# Altium schematic sheet BQ40Z50.SchDoc
size A2
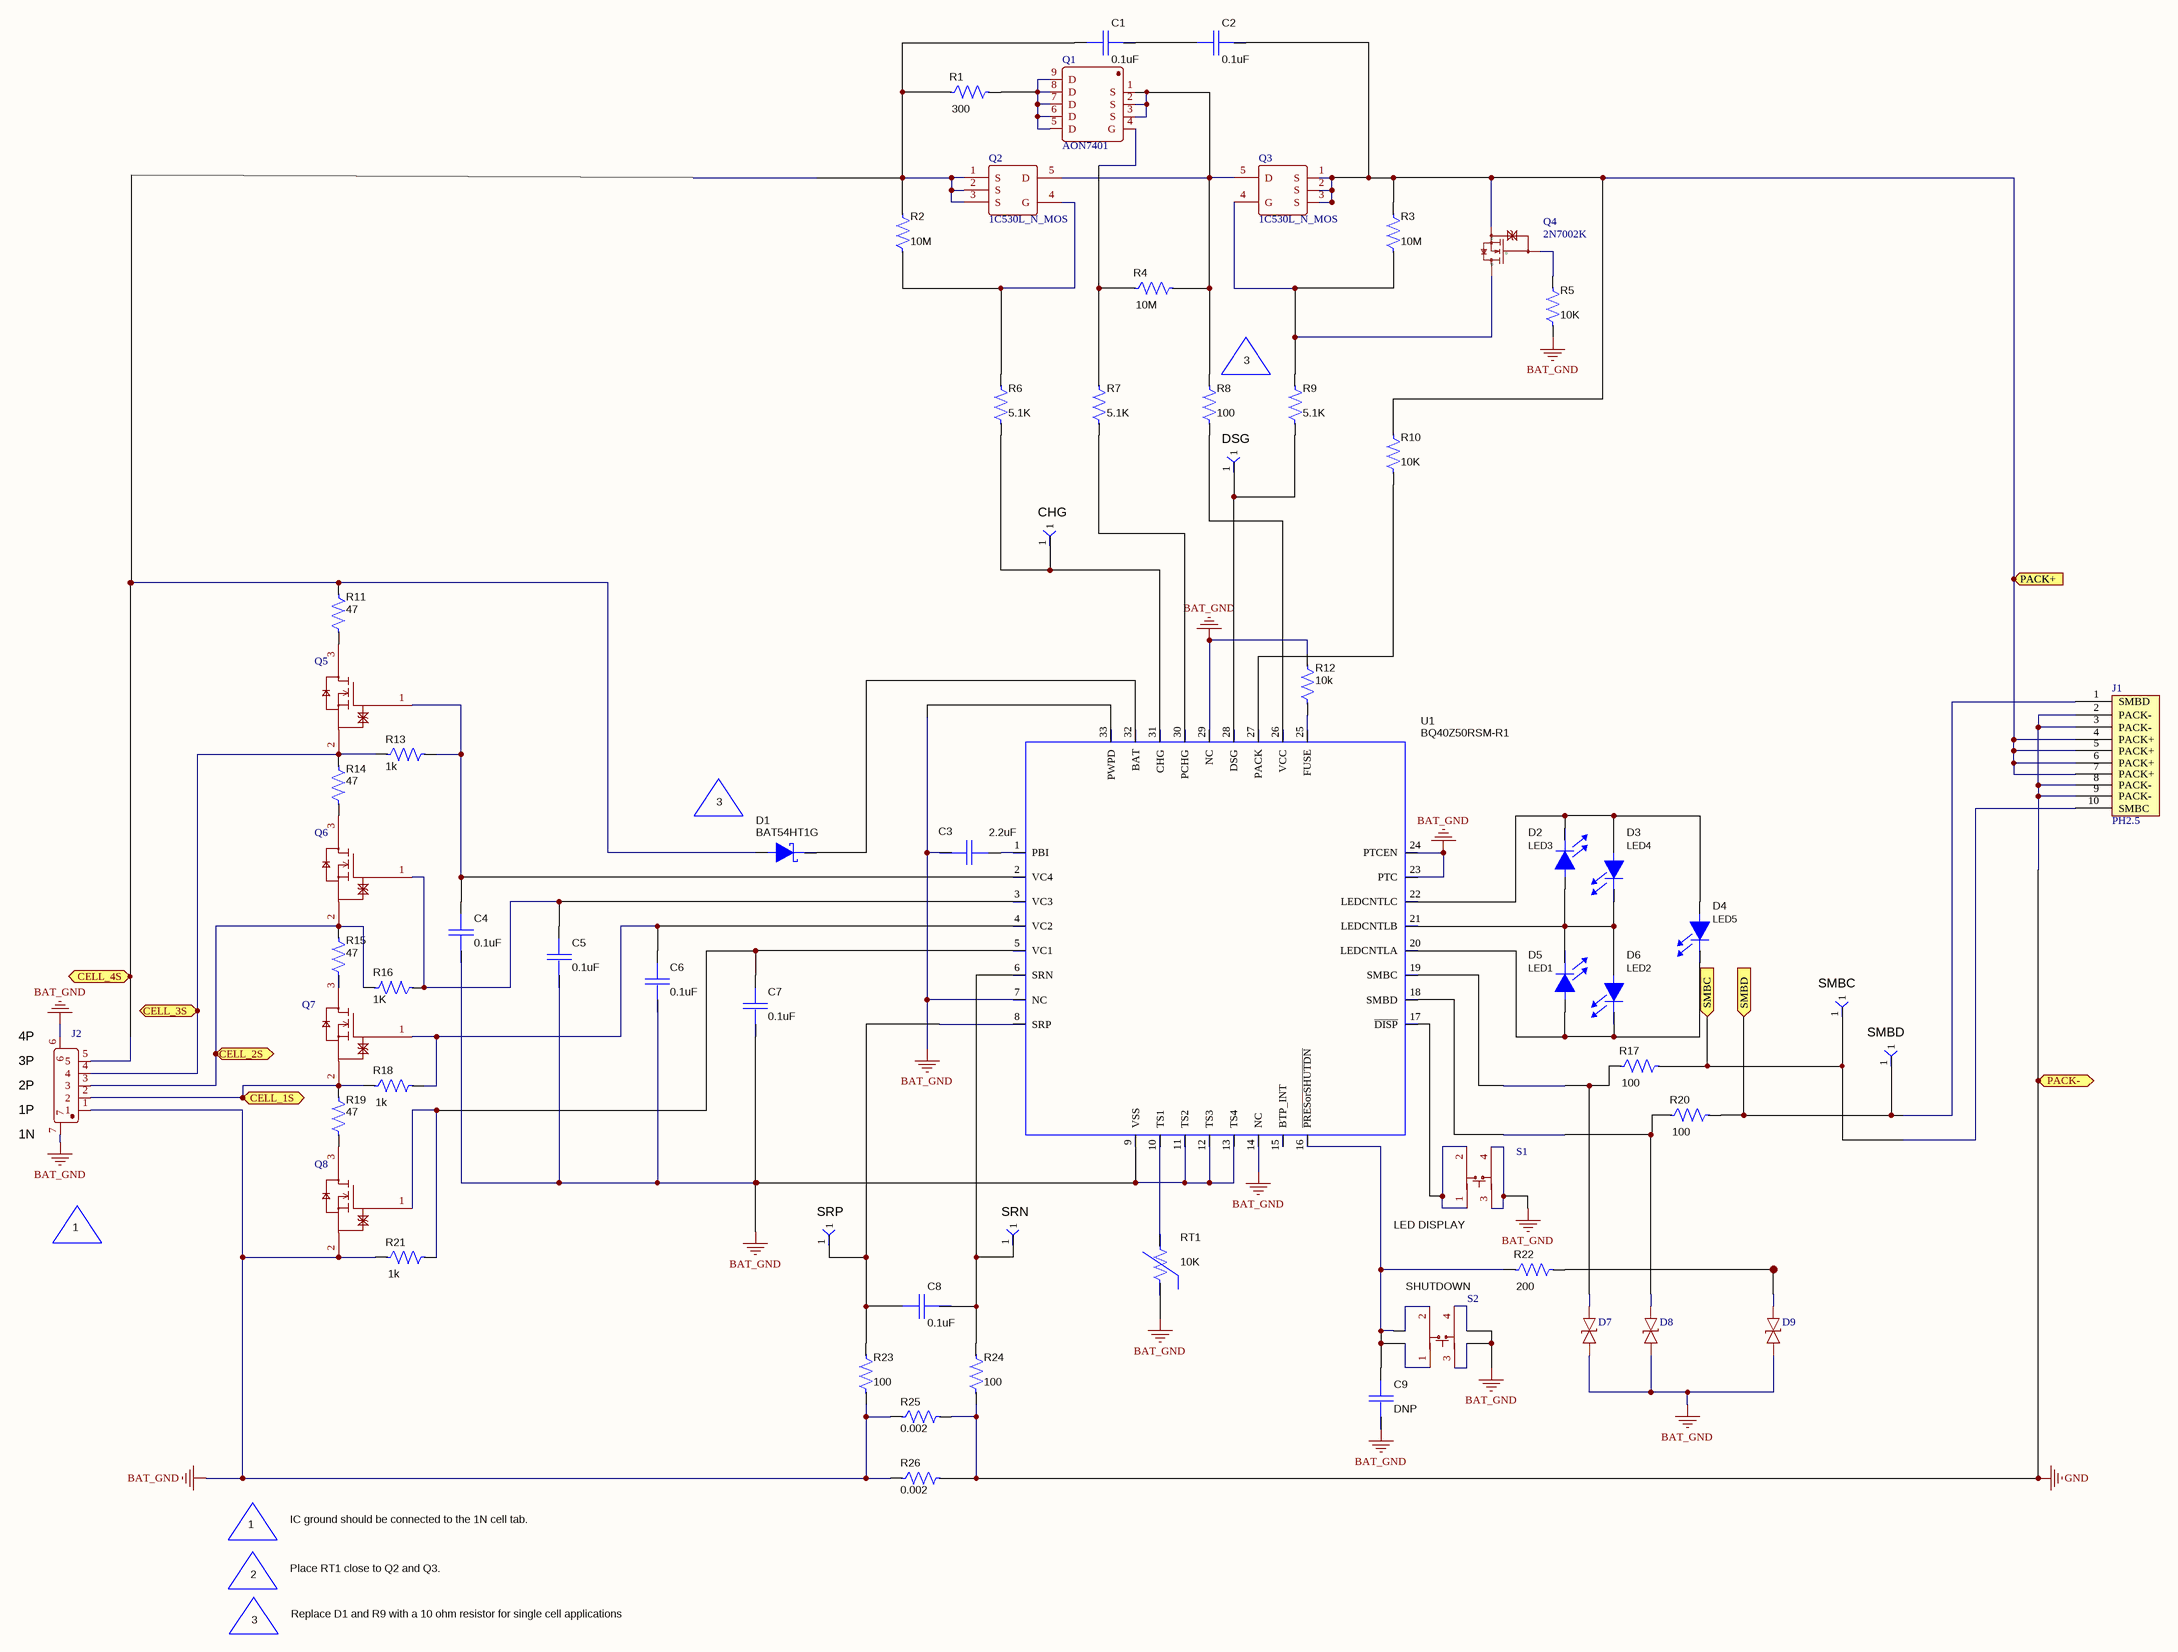
[diagram p0: BQ40Z50.SchDoc]

## Parts
C1  value 0.1uF  [C603]  (hidden comment: C0603C104M5RACTU)
C2  value 0.1uF  [C603]  (hidden comment: C0603C104M5RACTU)
C3  value 2.2uF  [C0805]  (hidden comment: C2012X7R1E225M085AB)
C4  value 0.1uF  [C603]  (hidden comment: C0603C104M5RACTU)
C5  value 0.1uF  [C603]  (hidden comment: C0603C104M5RACTU)
C6  value 0.1uF  [C603]  (hidden comment: C0603C104M5RACTU)
C7  value 0.1uF  [C603]  (hidden comment: C0603C104M5RACTU)
C8  value 0.1uF  [C603]  (hidden comment: C0603C104M5RACTU)
C9  value DNP  [C603]  (hidden comment: C0603C104M5RACTU)
D1  value BAT54HT1G  [SOD-323]  (hidden comment: D-BAT54HT1)
D2  D_LED_SML-LXR1206USBC-TR  [LED0805]  (value not drawn)
D3  D_LED_SML-LXR1206USBC-TR  [LED0805]  (value not drawn)
D4  D_LED_SML-LXR1206USBC-TR  [LED0805]  (value not drawn)
D5  D_LED_SML-LXR1206USBC-TR  [LED0805]  (value not drawn)
D6  D_LED_SML-LXR1206USBC-TR  [LED0805]  (value not drawn)
D7  ESD_Diode  [ESD_Diode]  (value not drawn)
D8  ESD_Diode  [ESD_Diode]  (value not drawn)
D9  ESD_Diode  [ESD_Diode]  (value not drawn)
J1  PH2.5  [PH2.5]
J2  SMD_1.25  [SMD_1.25]  (value not drawn)
Q1  AON7401  [DFN-8]
Q2  1C530L_N_MOS  [LFPAK]
Q3  1C530L_N_MOS  [LFPAK]
Q4  2N7002K  [2N7002K]
Q5  DMN601K  [SOT-23 - duplicate]  (value not drawn)
Q6  DMN601K  [SOT-23 - duplicate]  (value not drawn)
Q7  DMN601K  [SOT-23 - duplicate]  (value not drawn)
Q8  DMN601K  [SOT-23 - duplicate]  (value not drawn)
R1  value 300  [R2512]  (hidden comment: CRCW2512300RJNEG)
R2  value 10M  [0603]  (hidden comment: CRCW060310M0JNEA)
R3  value 10M  [0603]  (hidden comment: CRCW060310M0JNEA)
R4  value 10M  [0603]  (hidden comment: CRCW060310M0JNEA)
R5  value 10K  [0603]  (hidden comment: CRCW060310M0JNEA)
R6  value 5.1K  [0603]  (hidden comment: CRCW06035K10JNEA)
R7  value 5.1K  [0603]  (hidden comment: CRCW06035K10JNEA)
R8  value 100  [0603]  (hidden comment: CRCW0603100RJNEAHP)
R9  value 5.1K  [0603]  (hidden comment: CRCW06035K10JNEA)
R10  value 10K  [0603]  (hidden comment: CRCW060310K0JNEA)
R11  value 47  [R1206]  (hidden comment: CSR1206-0R001F1)
R12  value 10k  [0603]  (hidden comment: CRCW06035K10JNEA)
R13  value 1k  [0603]  (hidden comment: CRCW0603100RJNEAHP)
R14  value 47  [R1206]  (hidden comment: CSR1206-0R001F1)
R15  value 47  [R1206]  (hidden comment: CSR1206-0R001F1)
R16  value 1K  [0603]  (hidden comment: CRCW0603100RJNEAHP)
R17  value 100  [0603]  (hidden comment: CRCW0603100RJNEAHP)
R18  value 1k  [0603]  (hidden comment: CRCW0603100RJNEAHP)
R19  value 47  [R1206]  (hidden comment: CSR1206-0R001F1)
R20  value 100  [0603]  (hidden comment: CRCW0603100RJNEAHP)
R21  value 1k  [0603]  (hidden comment: CRCW0603100RJNEAHP)
R22  value 200  [0603]  (hidden comment: CRCW0603200RJNEA)
R23  value 100  [0603]  (hidden comment: CRCW0603100RJNEAHP)
R24  value 100  [0603]  (hidden comment: CRCW0603100RJNEAHP)
R25  value 0.002  [R2512]  (hidden comment: CRCW2512300RJNEG)
R26  value 0.002  [R2512]  (hidden comment: CRCW2512300RJNEG)
RT1  value 10K  [C0805]  (hidden comment: 103AT-2)
S1  SW_SMD  [SW_SMD]  (value not drawn)
S2  SW_SMD  [SW_SMD]  (value not drawn)
TP1  TP_.040_SMT  [TP_.040_SMT]  (value not drawn)  (no BOM)
TP2  TP_.040_SMT  [TP_.040_SMT]  (value not drawn)  (no BOM)
TP3  TP_.040_SMT  [TP_.040_SMT]  (value not drawn)  (no BOM)
TP4  TP_.040_SMT  [TP_.040_SMT]  (value not drawn)  (no BOM)
TP5  TP_40_SMT  [TP_40_SMT]  (value not drawn)  (no BOM)
TP6  TP_.040_SMT  [TP_.040_SMT]  (value not drawn)  (no BOM)
U1  value BQ40Z50RSM-R1  [QFP-32P_(RSM)]  (hidden comment: BQ40Z55RSM)

## Ports
CELL_1S, CELL_2S, CELL_3S, CELL_4S, PACK+, PACK-, SMBC, SMBD

## Nets
BAT_GND: C3.1 C4.1 C5.1 C6.1 C7.1 C9.1 D7.1 D8.1 D9.1 J2.1 J2.6 J2.7 Q8.2(S) R5.1 R12.2 R21.1 R23.1 R25.1 R26.1 RT1.1 S1.3 S1.4 S2.3 S2.4 U1.7(NC) U1.9(VSS) U1.11(TS2) U1.12(TS3) U1.13(TS4) U1.14(NC) U1.23(PTC) U1.24(PTCEN) U1.29(NC) U1.33(PWPD)
GND: J1.2(PACK-) J1.3(PACK-) J1.8(PACK-) J1.9(PACK-) R24.1 R25.2 R26.2 ; port PACK-
CELL_1S: J2.2 Q7.2(S) R18.1 R19.2 ; port CELL_1S
CELL_2S: J2.3 Q6.2(S) R15.2 R16.2 ; port CELL_2S
CELL_3S: J2.4 Q5.2(S) R13.1 R14.1 ; port CELL_3S
CELL_4S: C1.2 D1.2(A) J2.5 Q2.1(S) Q2.2(S) Q2.3(S) R1.1 R2.2 R11.1 ; port CELL_4S
PACK+: C2.1 J1.4(PACK+) J1.5(PACK+) J1.6(PACK+) J1.7(PACK+) Q3.1(S) Q3.2(S) Q3.3(S) Q4.2(S) R3.2 R10.2 ; port PACK+
SMBC: J1.10(SMBC) R17.2 TP3.1 ; port SMBC
SMBD: J1.1(SMBD) R20.2 TP4.1 ; port SMBD
NetC1_1: C1.1 C2.2
NetC3_2: C3.2 U1.1(PBI)
NetC4_2: C4.2 Q5.1(G) R13.2 U1.2(VC4)
NetC5_2: C5.2 Q6.1(G) R16.1 U1.3(VC3)
NetC6_2: C6.2 Q7.1(G) R18.2 U1.4(VC2)
NetC7_2: C7.2 Q8.1(G) R21.2 U1.5(VC1)
NetC8_1: C8.1 R24.2 TP6.1 U1.6(SRN)
NetC8_2: C8.2 R23.2 TP5.1 U1.8(SRP)
NetC9_2: C9.2 R22.1 S2.1 S2.2 U1.16(~{PRESorSHUTDN})
NetD1_1: D1.1(C) U1.32(BAT)
NetD2_1: D2.1(C) D3.2(A) D4.2(A) U1.22(LEDCNTLC)
NetD2_2: D2.2(A) D3.1(C) D5.1(C) D6.2(A) U1.21(LEDCNTLB)
NetD4_1: D4.1(C) D5.2(A) D6.1(C) U1.20(LEDCNTLA)
NetD7_2: D7.2 R17.1 U1.19(SMBC)
NetD8_2: D8.2 R20.1 U1.18(SMBD)
NetD9_2: D9.2 R22.2
NetQ1_1: Q1.1(S) Q1.2(S) Q1.3(S) Q2.5(D) Q3.5(D) R4.2 R8.2
NetQ1_4: Q1.4(G) R4.1 R7.2
NetQ1_5: Q1.5(D) Q1.6(D) Q1.7(D) Q1.8(D) Q1.9(D) R1.2
NetQ2_4: Q2.4(G) R2.1 R6.2
NetQ3_4: Q3.4(G) Q4.3(D) R3.1 R9.2
NetQ4_1: Q4.1(G) R5.2
NetQ5_3: Q5.3(D) R11.2
NetQ6_3: Q6.3(D) R14.2
NetQ7_3: Q7.3(D) R15.1
NetQ8_3: Q8.3(D) R19.1
NetR6_1: R6.1 TP2.1 U1.31(CHG)
NetR7_1: R7.1 U1.30(PCHG)
NetR8_1: R8.1 U1.26(VCC)
NetR9_1: R9.1 TP1.1 U1.28(DSG)
NetR10_1: R10.1 U1.27(PACK)
NetR12_1: R12.1 U1.25(FUSE)
NetRT1_2: RT1.2 U1.10(TS1)
NetS1_1: S1.1 S1.2 U1.17(~{DISP})

Not connected (* = marked no-connect by the designer): U1 15(BTP_INT)

## Notes on the sheet
- 3
- DSG
- (near TP2) CHG
- (near D2) LED3
- (near D3) LED4
- (near D4) LED5
- (near D5) LED1
- (near D6) LED2
- (near TP3) SMBC
- (near J2) 4P
- (near J2) 3P
- (near TP4) SMBD
- (near J2) 2P
- (near J2) 1P
- (near J2) 1N
- 1
- (near TP5) SRP
- (near TP6) SRN
- (near S1) LED DISPLAY
- (near S2) SHUTDOWN
- IC ground should be connected to the 1N cell tab.
- 2
- Place RT1 close to Q2 and Q3.
- Replace D1 and R9 with a 10 ohm resistor for single cell applications

## Library data of the parts
C1 C2 C4-C9 = C0603: Capacitor, Ceramic Chip, 50V, X7R, ±20%; Manufacturer: Kemet; Area: 5650; ComponentHeight: 0.035 inch; SymbolVersion: 07/31/2009 12:17:27; PartNumber: C0603C104M5RACTU; PackageReference: 603; ComponentLink1Description: AEO Datasheet Link
C3 = C0805: Capacitor, Ceramic Chip, 25V, X7R ±20%; Manufacturer: TDK; Area: 10560; ComponentHeight: 0.053 inch; SymbolVersion: 06/23/2010 08:22:44; PartNumber: C2012X7R1E225M085AB; PackageReference: 805; ComponentLink1Description: AEO Datasheet Link
D1 = D-BAT54HT1: Diode, Schottky, 200-mA, 30-V; Manufacturer: On Semi; Area: 14105; ComponentHeight: 0.043 inch; ComponentLink1URL: \\vette02\pmp_pcb\pcad_pdf's\BAT54HT1-D.pdf; SymbolVersion: 02/28/2007 14:26:03; PackageReference: SOD323; PartNumber: BAT54HT1G; ComponentLink1Description: AEO Datasheet Link
D2-D6 = D_LED_SML-LXR1206USBC-TR: Diode, LED, 2X3mm 565nm GRN WTR CLR SMD; PartNumber: SML-LX23GC; Manufacturer: Lumex; Area: 22000; Value: SML-LX23GC; ComponentLink1URL: \\vette02\pmp_pcb\pcad_pdf's\SML-LXR1206USBC-TR[1].pdf; SymbolVersion: 08/01/2007 15:25:38; PackageReference: 1206; ComponentHeight: 0.041 inch; ComponentLink1Description: AEO Datasheet Link
R1 R25 R26 = R2512_5%: Resistor, Chip 1W, 5%; Manufacturer: Vishay-Dale; Area: 56,000; SymbolVersion: 05/06/2011 14:04:06; PackageReference: 2512; PartNumber: CRCW2512300RJNEG; ComponentLink1Description: AEO Datasheet Link
R2-R10 R12 R13 R16-R18 R20 R21 R23 R24 = R0603_1%: Resistor, Chip, 1/10W, 5%; Manufacturer: Vishay-Dale; Area: 9100; SymbolVersion: 05/06/2011 13:51:33; PackageReference: 603; ComponentLink1Description: AEO Datasheet Link
  R2-R5: PartNumber: CRCW060310M0JNEA
  R6 R7 R9 R12: PartNumber: CRCW06035K10JNEA
  R8 R13 R16-R18 R20 R21 R23 R24: PartNumber: CRCW0603100RJNEAHP
  R10: PartNumber: CRCW060310K0JNEA
R11 R14 R15 R19 = R1206_1%: Resistor, Chip 1 watt, ±1%, 50 ppm; Manufacturer: Reidon; Area: 20,000; SymbolVersion: 05/06/2011 13:59:00; PackageReference: 1206; PartNumber: CSR1206-0R001F1; ComponentLink1Description: AEO Datasheet Link
R22 = R0603_1%: Resistor, Chip, 1/16W, 5%; Manufacturer: Vishay-Dale; Area: 9100; SymbolVersion: 05/06/2011 13:51:33; PackageReference: 603; PartNumber: CRCW0603200RJNEA; ComponentLink1Description: AEO Datasheet Link
RT1 = THERMISTOR-103AT: Thermistor, NTC, 3-A; Manufacturer: Semitec; Area: 25,000; ComponentHeight: 0.335 inch; ComponentLink1URL: \\vette02\pmp_pcb\pcad_pdf's\AT_Thermistor.pdf; PackageReference: 0.095 X 0.150 inch; SymbolVersion: 07/31/2009 12:17:31; PartNumber: 103AT-2; ComponentLink1Description: AEO Datasheet Link
TP1-TP4 TP6 = TP_.040_SMT: Test point, 40 mil SMT; Value: None; ComponentHeight: None; area: *; SymbolVersion: 11/01/2006 14:05:31; PackageReference: None; Manufacturer: None; PartNumber: None; ComponentLink1Description: AEO Datasheet Link
TP5 = TP_40_SMT: Test point, 40 mil SMT; Manufacturer: None; Value: None; ComponentHeight: None; SymbolVersion: 07/13/2010 09:50:06; area: *; PackageReference: None; PartNumber: None; ComponentLink1Description: AEO Datasheet Link
U1 = BQ40Z55RSM: IC, 2 to 4-Series Li-Ion Battery Pack Manager; Manufacturer: TI; Alternate Manufacturer: None; Area: 51072; ComponentHeight: 0.04mil; ComponentLink1URL: \\vette02\pmp_pcb\pcad_pdf's\bq40z55_DS.pdf; SymbolVersion: 06/22/2012 10:16:53; PackageReference: QFN; PartNumber: BQ40Z50RSM-R1; ComponentLink1Description: AEO Datasheet Link